# EasyEDA Pro project keyboard_s.eprj

# Schematic Schematic1
Board Name: Board1; Create Date: 2025-11-03; Page Name: P1; Project Name: keyboard_s; Schematic Name: Schematic1; Update Date: 2025-11-05; Company: 嘉立创EDA; Page Size: A4; Version: V1.0
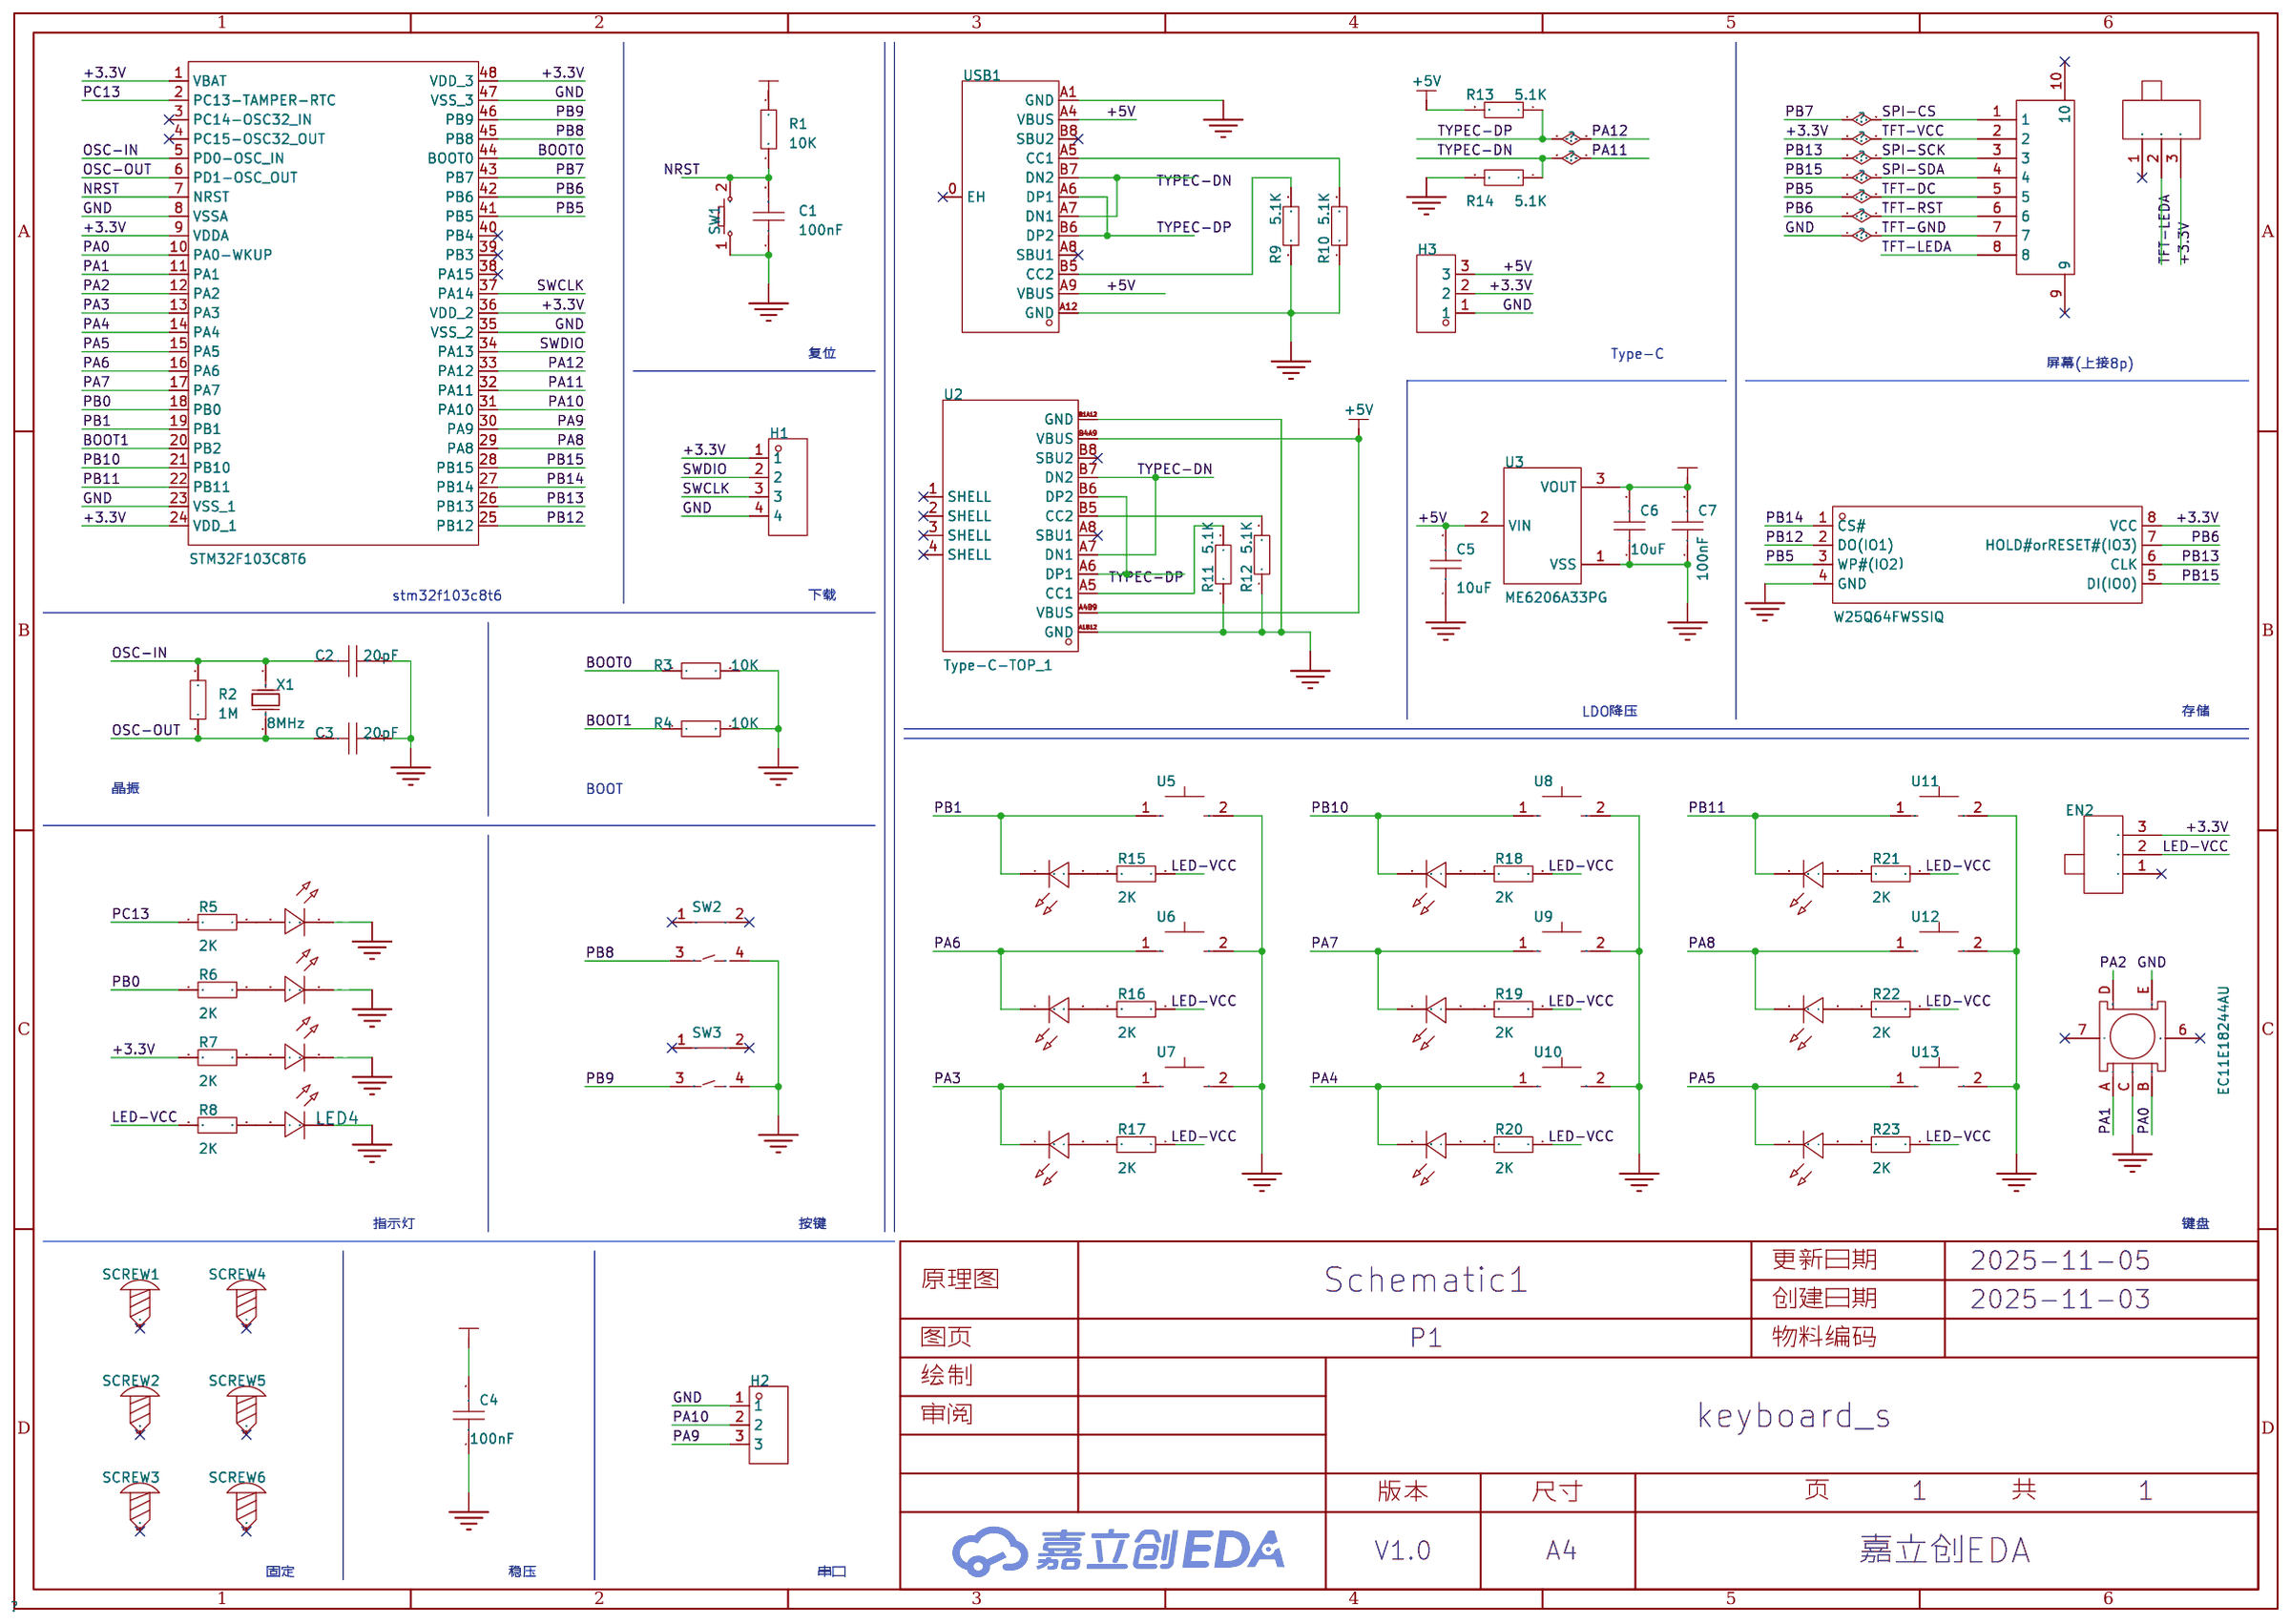
[diagram p0: schematic sheet]

## Parts
C1  100nF  [C0805]
C2  20pF  [C0805]
C3  20pF  [C0805]
C4  100nF  [C0805]
C5  10uF  [C0805]
C6  10uF  [C0805]
C7  100nF  [C0805]
EN1  MK-12C01N-G1.5  [SW-SMD_DEALON_MK-12C01N-G1.5]
EN2  MK-12C01N-G1.5  [SW-SMD_DEALON_MK-12C01N-G1.5]
FPC2  AFC07-S08ECA-00  [FPC-SMD_P0.5-8P_LCS-SH-H2.0]
H1  -  [HDR-TH_4P-P2.54-V-M]
H2  -  [HDR-TH_3P-P2.54-V-M]
H3  -  [HDR-TH_3P-P2.54-V-F]
LED1  -  [LED_0805]
LED2  -  [LED_0805]
LED3  -  [LED_0805]
LED4  -  [LED_0805]
LED5  -  [LED_0805]
LED6  -  [LED_0805]
LED7  -  [LED_0805]
LED8  -  [LED_0805]
LED9  -  [LED_0805]
LED10  -  [LED_0805]
LED11  -  [LED_0805]
LED12  -  [LED_0805]
LED13  -  [LED_0805]
R1  10K  [R0805]
R2  1M  [R0805]
R3  10K  [R0805]
R4  10K  [R0805]
R5  2K  [R0805]
R6  2K  [R0805]
R7  2K  [R0805]
R8  2K  [R0805]
R9  5.1K  [R0805]
R10  5.1K  [R0805]
R11  5.1K  [R0805]
R12  5.1K  [R0805]
R13  5.1K  [R0805]
R14  5.1K  [R0805]
R15  2K  [R0805]
R16  2K  [R0805]
R17  2K  [R0805]
R18  2K  [R0805]
R19  2K  [R0805]
R20  2K  [R0805]
R21  2K  [R0805]
R22  2K  [R0805]
R23  2K  [R0805]
SCREW1  -  [M3螺丝]
SCREW2  -  [M3螺丝]
SCREW3  -  [M3螺丝]
SCREW4  -  [M3螺丝]
SCREW5  -  [M3螺丝]
SCREW6  -  [M3螺丝]
SW1  -  [Key_SMD_3x4x2]
SW2  HX-2x4x3.5CA-2.5N  [SW-SMD_HX-2X4X3.5CA-2.5N]
SW3  HX-2x4x3.5CA-2.5N  [SW-SMD_HX-2X4X3.5CA-2.5N]
SW4  EC11E18244AU  [SW-TH_EC11XXXXXXXX]
U1  STM32F103C8T6  [LQFP-48_L7.0-W7.0-P0.50-LS9.0-BL]
U2  Type-C-TOP_1  [USB-C-SMD_TYPE-C16PIN]
U3  ME6206A33PG  [SOT-89-3_L4.5-W2.5-P1.50-LS4.2-BR]
U4  W25Q64FWSSIQ  [SOIC-8_L5.3-W5.3-P1.27-LS8.0-BL]
U5  -  [高特轴-轴座]
U6  -  [高特轴-轴座]
U7  -  [高特轴-轴座]
U8  -  [高特轴-轴座]
U9  -  [高特轴-轴座]
U10  -  [高特轴-轴座]
U11  -  [高特轴-轴座]
U12  -  [高特轴-轴座]
U13  -  [高特轴-轴座]
USB1  TYPE-C 16P QTWT  [USB-TYPE-C-SMD_TYPE-C-16P-QTWT]
X1  8MHz  [CRYSTAL-SMD_L11.5-W4.8-LS12.7]

## Library data of the parts
C1-C7 = CAP_0805: Supplier Footprint: 0805
EN1 EN2 = MK-12C01N-G1.5: 电路结构:单刀双掷;安装方式:卧贴;开关颜色:黑色;机械寿命:-;; LCSC Part Name: 微型拨动开关; Supplier Part: C2904923; Manufacturer: DEALON(德艺隆); Supplier Footprint: SMD; JLCPCB Part Class: 扩展库; Datasheet: https://atta.szlcsc.com/upload/public/pdf/source/20211116/DB0E76B2A5CCB6919F2C3E33154185CD.pdf; Supplier: LCSC; Circuit: 单刀双掷; Actuator Style: 矩形柱状; Pin Style: 鸥翼型; Switch Length: 7mm; Switch Width: 1.5mm; Switch Height: 4.5mm; Mounting Style: 卧贴; Actuator Color: 黑色
FPC2 = AFC07-S08ECA-00: LCSC Part Name: 间距:0.5mm P数:8P 抽屉式 上接; Supplier Part: C262581; Manufacturer: JS(钜硕电子); Supplier Footprint: SMD,P=0.5mm,卧贴; JLCPCB Part Class: 扩展库; Datasheet: https://atta.szlcsc.com/upload/public/pdf/source/20190726/C11082_A2E7B12387019CE4314BB5199EE0FDF4.pdf; Supplier: LCSC; Locking Feature: 抽屉式; Contact Type: 上接; Number of Contacts: 8P; Pitch: 0.5mm; Mounting Type: 卧贴; FFC, FCB Thickness: 0.3mm; Height Above Board: 2mm
H1 = HDR-M_2.54_1x4P: Supplier Part: C492403; Supplier Footprint: 插件
H2 = HDR-M_2.54_1x3P: Supplier Part: C2937625; Supplier Footprint: 插件
H3 = HDR-F_2.54_1x3P: Supplier Part: C541850; Supplier Footprint: 插件
LED1 LED2 LED5-LED13 = LED_0805-B: Supplier Footprint: 0805
LED3 = LED_0805-G: Supplier Footprint: 0805
LED4 = LED_0805-R: Supplier Footprint: 0805
R1-R23 = Res_0805: Supplier Footprint: 0805
SCREW1-SCREW6 = M3螺丝: Supplier Footprint: 插件
SW1 = Key_SMD_3x4x2: Supplier Footprint: SMD
SW2 SW3 = HX-2x4x3.5CA-2.5N: 电路结构:单刀单掷;按钮形状:-;作用力:2.5N;安装方式:卧贴;开关长度:4.55mm;开关宽度:1.8mm;开关高度:3.5mm;带支架:不带支架;触点电流:50mA;额定电压:12V;带灯:无;工作寿命:2万次;; LCSC Part Name: 4.55*1.8*3.5mm 卧贴 轻触开关; Supplier Part: C49234137; Manufacturer: hanxia(韩下); Supplier Footprint: SMD; JLCPCB Part Class: 扩展库; Datasheet: https://item.szlcsc.com/datasheet/HX-2x4x3.5CA-2.5N/51650198.html; Supplier: LCSC; Circuit: 单刀单掷; Operating Force: 2.5N; Mounting Type: 卧贴; Length: 4.55mm; Width: 1.8mm; Switch Height: 3.5mm; with Bracket: 不带支架; Contact Current: 50mA; Voltage Rating: 12V; Actuator/Cap Color: 黑色; With Lamp: 无; Termination Style: SMD接片; Life: 2万次
SW4 = EC11E18244AU: Supplier Part: C202365; Manufacturer: ALPSALPINE(阿尔卑斯阿尔派); Supplier Footprint: 插件; JLCPCB Part Class: 扩展库; Datasheet: https://item.szlcsc.com/datasheet/EC11E18244AU/203565.html; Supplier: LCSC
U1 = STM32F103C8T6_C9900100366: Supplier Part: C9900100366; Supplier Footprint: TH-6P; JLCPCB Part Class: 扩展库; Supplier: LCSC
U2 = Type-C-TOP_1: Supplier Part: C9900005857; Supplier Footprint: Type-C16P; JLCPCB Part Class: 扩展库; Supplier: LCSC
U3 = ME6206A33PG: 输出类型:固定;工作电压:6V;输出电压:3.3V;输出电流:300mA;电源纹波抑制比(PSRR):50dB@(1kHz);输出极性:正极;; LCSC Part Name: 输入6V 输出3.3V 300mA; Supplier Part: C79022; Manufacturer: MICRONE(南京微盟); Supplier Footprint: SOT-89-3; JLCPCB Part Class: 扩展库; Datasheet: https://item.szlcsc.com/datasheet/ME6206A33PG/80159.html; Supplier: LCSC; Output Type: 固定; Voltage - Supply: 6V; Output Voltage: 3.3V; Output Current: 300mA; Power Supply Rejection Ratio (PSRR): 50dB@(1kHz); Voltage Dropout: 180mV@(80mA)；380mV@(200mA); standby current: 9uA; Features: 过流保护; Operating Temperature: -25℃~+85℃; Output Configuration: 正极; Number of Outputs: 1
U4 = W25Q64FWSSIQ: Supplier Part: C783717; Manufacturer: WINBOND(华邦); Supplier Footprint: SOIC-8-208mil; JLCPCB Part Class: 扩展库; Datasheet: https://atta.szlcsc.com/upload/public/pdf/source/20200914/C783717_9592DB26B3553414A1014E6A69EB35F2.pdf; Supplier: LCSC
U5-U13 = 高特轴-轴座
USB1 = TYPE-C 16P QTWT: LCSC Part Name: Type-C 母 卧贴; Supplier Part: C5187472; Manufacturer: SHOU HAN(首韩); Supplier Footprint: SMD; JLCPCB Part Class: 扩展库; Datasheet: https://item.szlcsc.com/datasheet/TYPE-C%252016P%2520QTWT/5860367.html; Supplier: LCSC; Connector Type: Type-C; Protocol Standard: USB 3.1; Gender: 母; Mounting Type: 卧贴; Number of Contacts: 16P; Number of Ports: 1; Current Rating-Power: 3A; Voltage Rating: 5V; Connect-Disconnect Life: 5千次; Detection color: 黑色; Operating Temperature: -25℃~+85℃
X1 = X49SM8MSD2SC: 晶振类型:贴片晶振;频率:8MHz;常温频差:±20ppm;外接负载电容:20pF;频率稳定度(全温):±30ppm;; LCSC Part Name: 8MHz ±20ppm 20pF; Supplier Part: C12674; Manufacturer: YXC(扬兴晶振); Supplier Footprint: HC-49S-SMD; JLCPCB Part Class: 基础库; Datasheet: https://atta.szlcsc.com/upload/public/pdf/source/20240329/3EBF42EBCAB50CA65B6FA9D7CFA1955A.pdf; Supplier: LCSC; Crystal Type: 贴片晶振; Normal temperature Frequency Tolerance: ±20ppm; External load capacitor: 20pF; Frequency Stability(Full temperature range): ±30ppm; Operating Temperature: -20℃~+70℃; Check: true

## Nets
+3.3V: C4.2 C6.2 C7.2 EN1.3 EN2.3 FPC2.2 H1.1 H3.2 R1.2 R7.1 U1.1(VBAT) U1.9(VDDA) U1.24(VDD_1) U1.36(VDD_2) U1.48(VDD_3) U3.3(VOUT) U4.8(VCC)
+5V: C5.2 H3.3 R13.2 U2.A4B9(VBUS) U2.B4A9(VBUS) U3.2(VIN) USB1.A4(VBUS) USB1.A9(VBUS)
GND: C1.1 C2.2 C3.2 C4.1 C5.1 C6.1 C7.1 FPC2.7 H1.4 H2.1 H3.1 LED1.1(C) LED2.1(C) LED3.1(C) LED4.1(C) R3.2 R4.2 R9.1 R10.1 R11.1 R12.1 R14.2 SW1.1 SW2.4 SW3.4 SW4.C SW4.E U1.8(VSSA) U1.23(VSS_1) U1.35(VSS_2) U1.47(VSS_3) U2.A1B12(GND) U2.B1A12(GND) U3.1(VSS) U4.4(GND) U5.2 U6.2 U7.2 U8.2 U9.2 U10.2 U11.2 U12.2 U13.2 USB1.A1(GND) USB1.A12(GND)
BOOT0: R3.1 U1.44(BOOT0)
BOOT1: R4.1 U1.20(PB2)
LED-VCC: EN2.2 R8.1 R15.1 R16.1 R17.1 R18.1 R19.1 R20.1 R21.1 R22.1 R23.1
NRST: C1.2 R1.1 SW1.2 U1.7(NRST)
OSC-IN: C2.1 R2.2 U1.5(PD0-OSC_IN) X1.1(OSC1)
OSC-OUT: C3.1 R2.1 U1.6(PD1-OSC_OUT) X1.2(OSC2)
PA0: SW4.B U1.10(PA0-WKUP)
PA1: SW4.A U1.11(PA1)
PA2: SW4.D U1.12(PA2)
PA3: LED7.1(C) U1.13(PA3) U7.1
PA4: LED10.1(C) U1.14(PA4) U10.1
PA5: LED13.1(C) U1.15(PA5) U13.1
PA6: LED6.1(C) U1.16(PA6) U6.1
PA7: LED9.1(C) U1.17(PA7) U9.1
PA8: LED12.1(C) U1.29(PA8) U12.1
PA9: H2.3 U1.30(PA9)
PA10: H2.2 U1.31(PA10)
PA11: R14.1 U1.32(PA11) U2.A7(DN1) U2.B7(DN2) USB1.A7(DN1) USB1.B7(DN2)
PA12: R13.1 U1.33(PA12) U2.A6(DP1) U2.B6(DP2) USB1.A6(DP1) USB1.B6(DP2)
PB0: R6.1 U1.18(PB0)
PB1: LED5.1(C) U1.19(PB1) U5.1
PB5: FPC2.5 U1.41(PB5) U4.3(WP#(IO2）)
PB6: FPC2.6 U1.42(PB6) U4.7(HOLD#orRESET#(IO3))
PB7: FPC2.1 U1.43(PB7)
PB8: SW2.3 U1.45(PB8)
PB9: SW3.3 U1.46(PB9)
PB10: LED8.1(C) U1.21(PB10) U8.1
PB11: LED11.1(C) U1.22(PB11) U11.1
PB12: U1.25(PB12) U4.2(DO(IO1))
PB13: FPC2.3 U1.26(PB13) U4.6(CLK)
PB14: U1.27(PB14) U4.1(CS#)
PB15: FPC2.4 U1.28(PB15) U4.5(DI(IO0))
PC13: R5.1 U1.2(PC13-TAMPER-RTC)
SWCLK: H1.3 U1.37(PA14)
SWDIO: H1.2 U1.34(PA13)
TFT-LEDA: EN1.2 FPC2.8
$1N3220: LED2.2(A) R6.2
$1N3613: LED9.2(A) R19.2
$1N3993: R11.2 U2.A5(CC1)
$1N3998: R12.2 U2.B5(CC2)
$1N4409: LED3.2(A) R7.2
$1N4735: LED12.2(A) R22.2
$1N4737: LED13.2(A) R23.2
$1N4739: LED11.2(A) R21.2
$1N4741: LED8.2(A) R18.2
$1N4743: LED10.2(A) R20.2
$1N4745: LED7.2(A) R17.2
$1N4747: LED6.2(A) R16.2
$1N4749: LED5.2(A) R15.2
$1N5293: LED4.2(A) R8.2
$1N7275: R9.2 USB1.B5(CC2)
$1N7284: R10.2 USB1.A5(CC1)
$1N9357: LED1.2(A) R5.2

Not connected (* = marked no-connect by the designer): EN1 1*; EN2 1*; FPC2 9* 10*; SCREW1 1*; SCREW2 1*; SCREW3 1*; SCREW4 1*; SCREW5 1*; SCREW6 1*; SW2 1* 2*; SW3 1* 2*; SW4 6* 7*; U1 3(PC14-OSC32_IN)* 4(PC15-OSC32_OUT)* 38(PA15)* 39(PB3)* 40(PB4)*; U2 1(SHELL)* 2(SHELL)* 3(SHELL)* 4(SHELL)* A8(SBU1)* B8(SBU2)*; USB1 0(EH)* A8(SBU1)* B8(SBU2)*

## Notes on the sheet
- 复位
- Type-C
- 屏幕(上接8p)
- stm32f103c8t6
- 下载
- LDO降压
- 存储
- 晶振
- BOOT
- 指示灯
- 按键
- 键盘
- 固定
- 稳压
- 串口

# Board PCB1
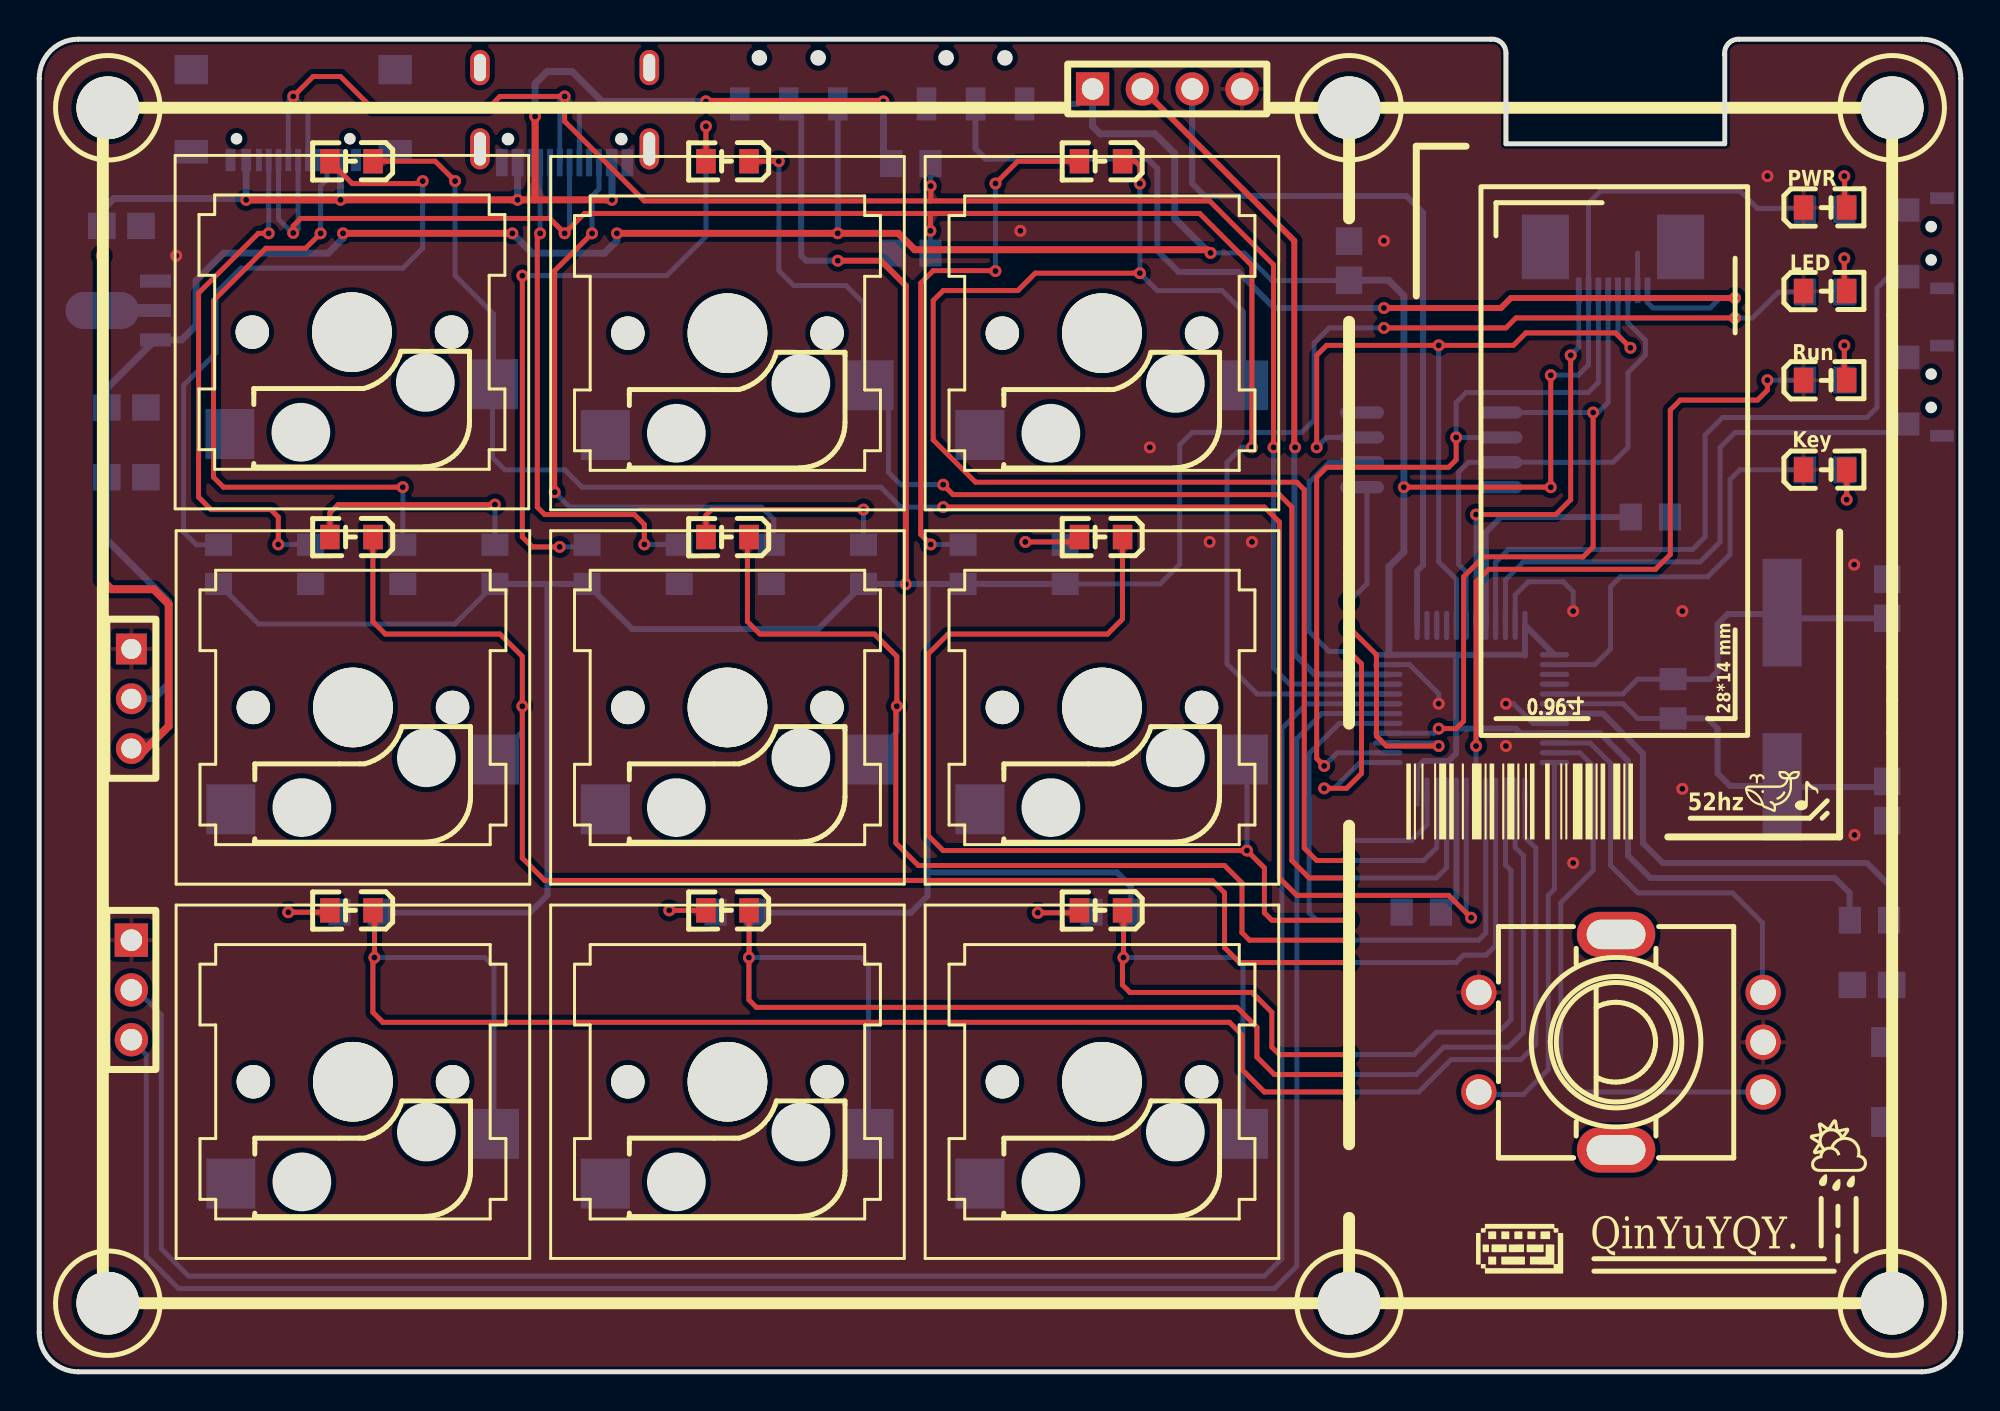
[diagram p1: board, top side]
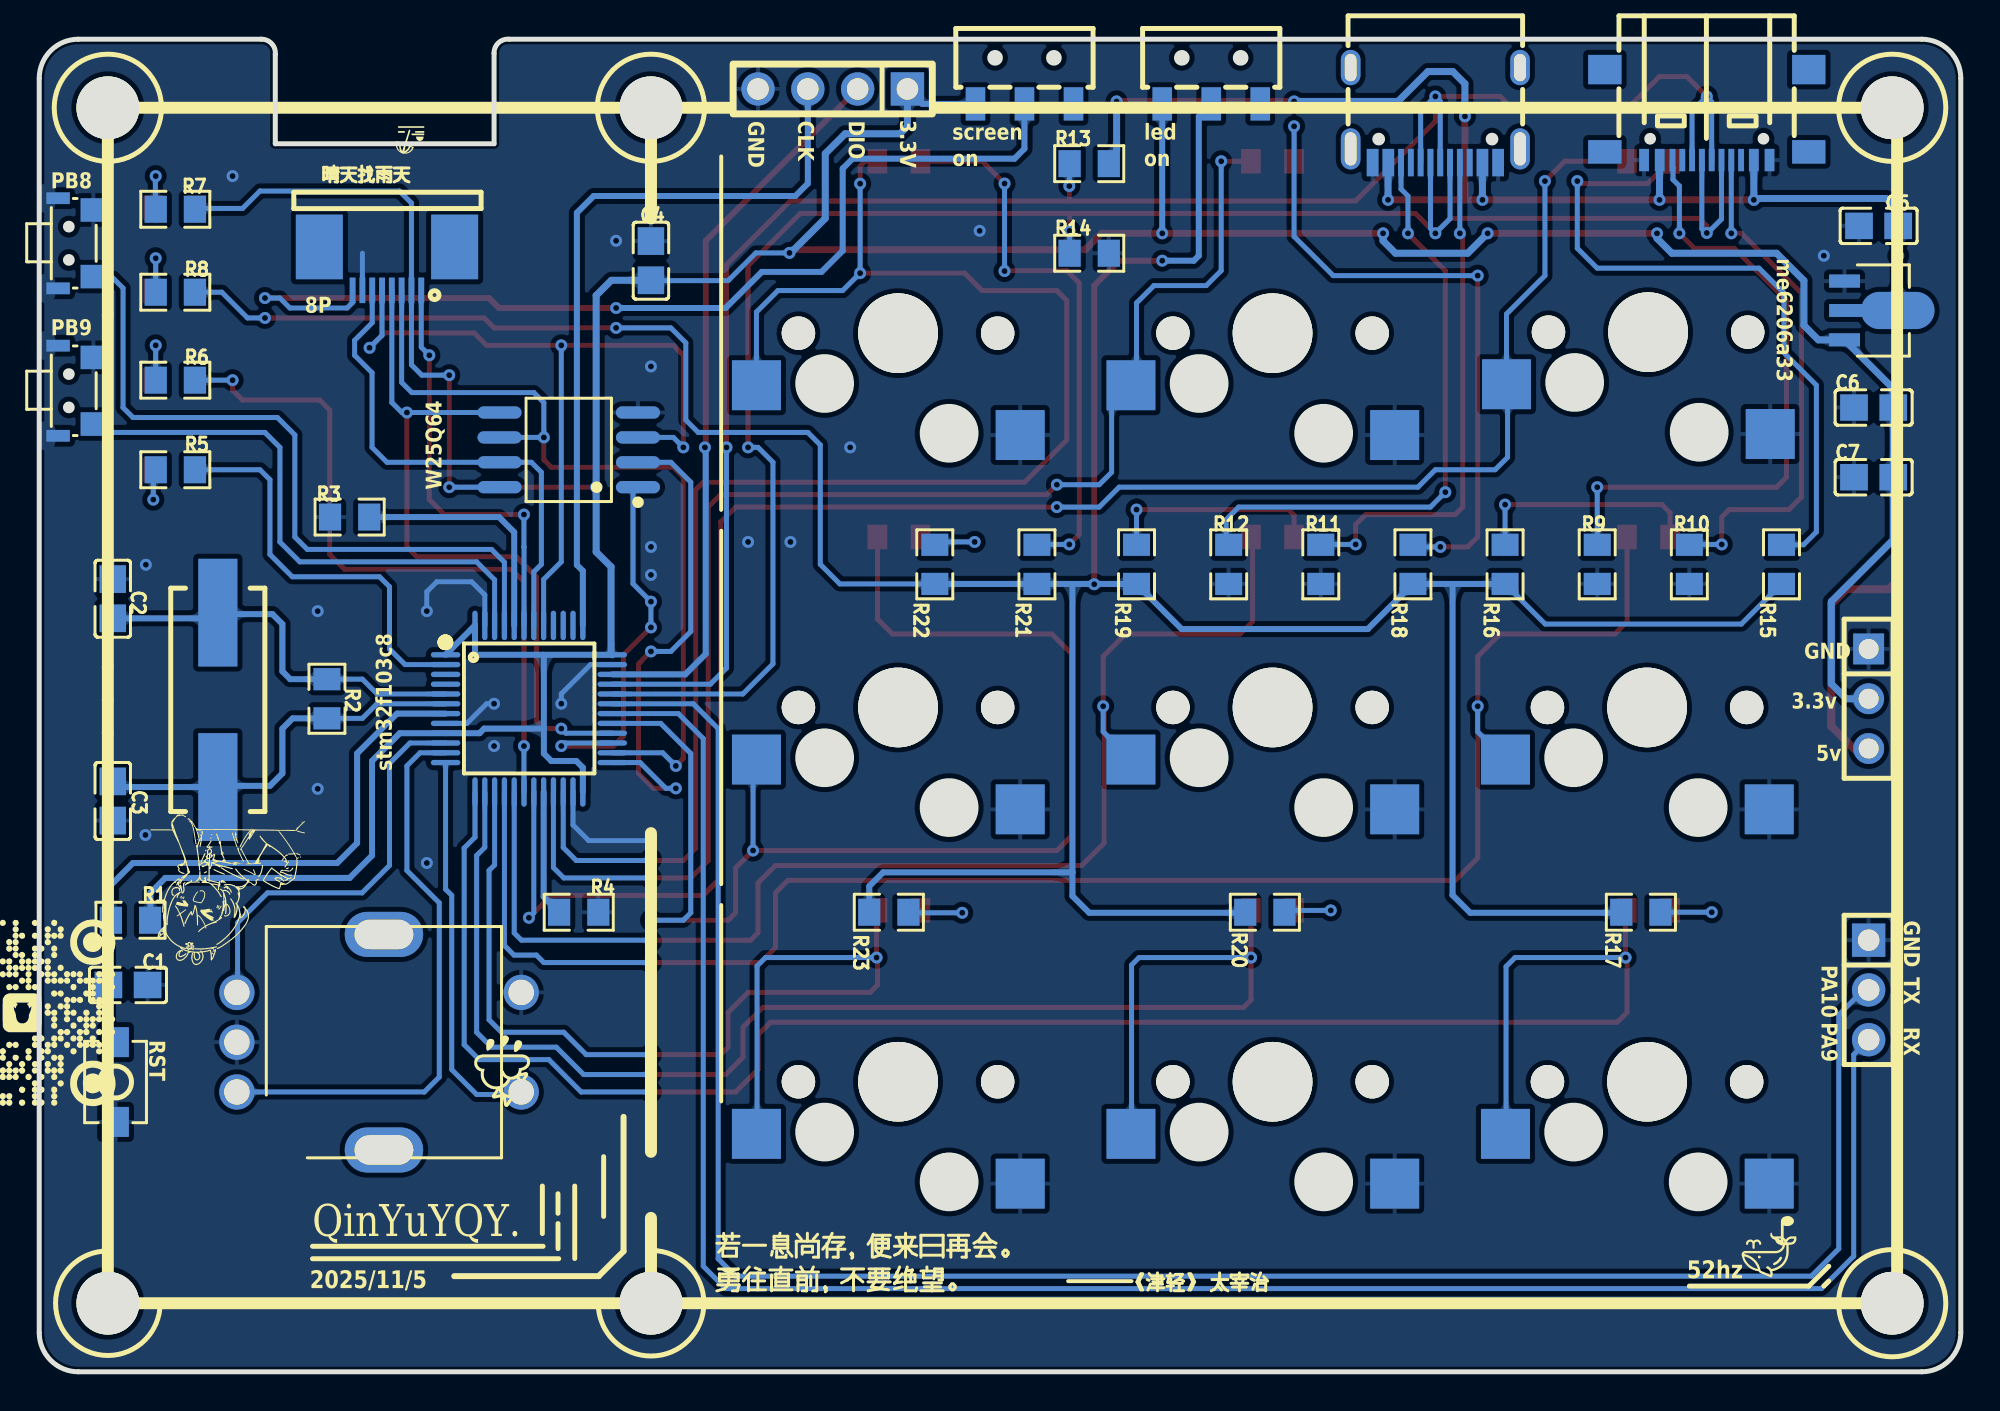
[diagram p2: board, bottom side, seen from below]

Outline 98 x 68 mm; copper layers: Top Layer, Bottom Layer. Coordinates in mm from the lower left corner of the outline.
Outline path: 0,66 arc(0.59,67.41) 2,68 74.03,68 arc(74.58,67.81) 74.8,67.27 74.8,62.67 85.96,62.67 85.96,67.22 arc(86.15,67.78) 86.69,68 96,68 arc(97.41,67.41) 98,66 98,2 arc(97.41,0.59) 96,0 2,0 arc(0.59,0.59) 0,2 0,66
Stack: Top Layer 0.035mm / Dielectric1 1.51mm FR4 er 4.5 / Bottom Layer 0.035mm

## Design rules (mm)
net OSC-IN: DP2
net OSC-OUT: DP2
net PA11: DP1
net PA12: DP1
template: 自定义配置
spacing copperThickness1oz (default): track to track 0.102, other pairs 0.152 to 0.3
spacing copperThickness2oz: track to track 0.203, other pairs 0.152 to 0.3
track width copperThickness1oz (default): min 0.127, default 0.254, max 2.54
track width copperThickness2oz: min 0.203, default 0.254, max 2.54
differential pair differentialPair (default): width min 0.127, default 0.254, max 2.54; gap min 0.152, default 0.152
via viaSize (default): diameter min 0.5, default 0.61, max 10; hole min 0.3, default 0.305, max 6.3

## Placement (name value [footprint] x y rotation side)
C1  100nF  [C0805]  93.47 19.74 0 bottom
C2  20pF  [C0805]  94.25 39.45 90 bottom
C3  20pF  [C0805]  94.25 29.13 270 bottom
C4  100nF  [C0805]  66.8 56.7 270 bottom
C5  10uF  [C0805]  4.19 58.47 180 bottom
C6  10uF  [C0805]  4.44 49.2 180 bottom
C7  100nF  [C0805]  4.44 45.65 180 bottom
EN1  MK-12C01N-G1.5  [SW-SMD_DEALON_MK-12C01N-G1.5]  47.75 64.7 0 bottom
EN2  MK-12C01N-G1.5  [SW-SMD_DEALON_MK-12C01N-G1.5]  38.23 64.7 0 bottom
FPC2  AFC07-S08ECA-00  [FPC-SMD_P0.5-8P_LCS-SH-H2.0]  80.26 56.32 180 bottom
H1  -  [HDR-TH_4P-P2.54-V-M]  57.53 65.46 0 bottom
H2  -  [HDR-TH_3P-P2.54-V-M]  4.7 19.49 270 bottom
H3  -  [HDR-TH_3P-P2.54-V-F]  4.7 34.34 270 bottom
LED1  -  [LED_0805]  91.13 46.03 0 top
LED2  -  [LED_0805]  91.13 50.59 0 top
LED3  -  [LED_0805]  91.13 59.41 0 top
LED4  -  [LED_0805]  91.13 55.14 0 top
LED5  -  [LED_0805]  15.88 61.78 180 top
LED6  -  [LED_0805]  15.88 42.6 180 top
LED7  -  [LED_0805]  15.88 23.55 180 top
LED8  -  [LED_0805]  35.05 61.78 180 top
LED9  -  [LED_0805]  35.05 42.6 180 top
LED10  -  [LED_0805]  35.05 23.55 180 top
LED11  -  [LED_0805]  54.1 61.78 180 top
LED12  -  [LED_0805]  54.1 42.6 180 top
LED13  -  [LED_0805]  54.1 23.55 180 top
R1  10K  [R0805]  93.34 23.04 180 bottom
R2  1M  [R0805]  83.33 34.34 90 bottom
R3  10K  [R0805]  82.17 43.62 0 bottom
R4  10K  [R0805]  70.49 23.45 180 bottom
R5  2K  [R0805]  91.06 46.03 0 bottom
R6  2K  [R0805]  91.06 50.6 0 bottom
R7  2K  [R0805]  91.06 59.32 0 bottom
R8  2K  [R0805]  91.06 55.09 0 bottom
R9  5.1K  [R0805]  18.54 41.2 90 bottom
R10  5.1K  [R0805]  13.84 41.2 90 bottom
R11  5.1K  [R0805]  32.64 41.2 90 bottom
R12  5.1K  [R0805]  37.34 41.2 90 bottom
R13  5.1K  [R0805]  44.45 61.65 180 bottom
R14  5.1K  [R0805]  44.45 57.08 180 bottom
R15  2K  [R0805]  9.14 41.2 90 bottom
R16  2K  [R0805]  23.24 41.2 90 bottom
R17  2K  [R0805]  16.31 23.45 180 bottom
R18  2K  [R0805]  27.94 41.2 90 bottom
R19  2K  [R0805]  42.04 41.2 90 bottom
R20  2K  [R0805]  35.49 23.45 180 bottom
R21  2K  [R0805]  47.12 41.2 90 bottom
R22  2K  [R0805]  52.32 41.2 90 bottom
R23  2K  [R0805]  54.67 23.45 180 bottom
SCREW1  -  [M3螺丝]  3.5 64.5 0 top
SCREW2  -  [M3螺丝]  94.5 3.5 0 top
SCREW3  -  [M3螺丝]  3.5 3.5 0 top
SCREW4  -  [M3螺丝]  94.5 64.5 0 top
SCREW5  -  [M3螺丝]  66.8 64.5 0 top
SCREW6  -  [M3螺丝]  66.8 3.5 0 top
SW1  -  [Key_SMD_3x4x2]  94.11 14.79 90 bottom
SW2  HX-2x4x3.5CA-2.5N  [SW-SMD_HX-2X4X3.5CA-2.5N]  96.14 57.59 90 bottom
SW3  HX-2x4x3.5CA-2.5N  [SW-SMD_HX-2X4X3.5CA-2.5N]  96.14 50.06 90 bottom
SW4  EC11E18244AU  [SW-TH_EC11XXXXXXXX]  80.67 16.82 90 top
U1  STM32F103C8T6  [LQFP-48_L7.0-W7.0-P0.50-LS9.0-BL]  73.03 33.84 270 bottom
U2  Type-C-TOP_1  [USB-C-SMD_TYPE-C16PIN]  26.8 64.19 0 bottom
U3  ME6206A33PG  [SOT-89-3_L4.5-W2.5-P1.50-LS4.2-BR]  4.57 54.16 0 bottom
U4  W25Q64FWSSIQ  [SOIC-8_L5.3-W5.3-P1.27-LS8.0-BL]  70.99 47.05 90 bottom
U5  -  [高特轴-轴座]  15.95 53.05 180 bottom
U6  -  [高特轴-轴座]  16 33.9 180 bottom
U7  -  [高特轴-轴座]  16 14.8 180 bottom
U8  -  [高特轴-轴座]  35.1 53 180 bottom
U9  -  [高特轴-轴座]  35.1 33.9 180 bottom
U10  -  [高特轴-轴座]  35.1 14.8 180 bottom
U11  -  [高特轴-轴座]  54.2 53 180 bottom
U12  -  [高特轴-轴座]  54.2 33.9 180 bottom
U13  -  [高特轴-轴座]  54.2 14.8 180 bottom
USB1  TYPE-C 16P QTWT  [USB-TYPE-C-SMD_TYPE-C-16P-QTWT]  12.95 64.14 0 bottom
X1  8MHz  [CRYSTAL-SMD_L11.5-W4.8-LS12.7]  88.89 34.29 270 bottom

## Footprints (pads in the part's own frame, mm; a bottom-side part is the same pattern mirrored in y, then rotated)
C0805
  rect 1.41x1.35 smd: 1(-1,0) 2(1,0)
CRYSTAL-SMD_L11.5-W4.8-LS12.7
  rect 5.5x2 smd: 1(-4.45,0) 2(4.45,0)
FPC-SMD_P0.5-8P_LCS-SH-H2.0
  rect 0.3x1.3 smd: 1(1.748,-1.133) 2(1.248,-1.133) 3(0.748,-1.133) 4(0.248,-1.133) 5(-0.252,-1.133) 6(-0.752,-1.133) 7(-1.252,-1.133) 8(-1.754,-1.133)
  rect 2.4x3.3 smd: 9(3.45,1.084) 10(-3.45,1.084)
HDR-TH_3P-P2.54-V-F
  rect 1.575x1.575 hole 1.02: 1(-2.54,0)
  round 1.575 hole 1.02: 2(0,0) 3(2.54,0)
HDR-TH_3P-P2.54-V-M
  rect 1.7x1.7 hole 1.1: 1(-2.54,0)
  round 1.7 hole 1.1: 2(0,0) 3(2.54,0)
HDR-TH_4P-P2.54-V-M
  rect 1.7x1.7 hole 1.1: 1(-3.81,0)
  round 1.7 hole 1.1: 2(-1.27,0) 3(1.27,0) 4(3.81,0)
Key_SMD_3x4x2
  rect 1.53x1.36 smd: 1(-2.035,0) 2(2.035,0)
LED_0805
  rect 1x1.25 smd: 1(-1.15,0.005) 2(1.05,0.005)
LQFP-48_L7.0-W7.0-P0.50-LS9.0-BL
  oval 0.27x1.5 smd: 1(-2.75,-4.25) 2(-2.25,-4.25) 3(-1.75,-4.25) 4(-1.25,-4.25) 5(-0.75,-4.25) 6(-0.25,-4.25) 7(0.25,-4.25) 8(0.75,-4.25) 9(1.25,-4.25) 10(1.75,-4.25) 11(2.25,-4.25) 12(2.75,-4.25) 25(2.75,4.25) 26(2.25,4.25) 27(1.75,4.25) 28(1.25,4.25) 29(0.75,4.25) 30(0.25,4.25) 31(-0.25,4.25) 32(-0.75,4.25) 33(-1.25,4.25) 34(-1.75,4.25) 35(-2.25,4.25) 36(-2.75,4.25)
  oval 1.5x0.27 smd: 13(4.25,-2.75) 14(4.25,-2.25) 15(4.25,-1.75) 16(4.25,-1.25) 17(4.25,-0.75) 18(4.25,-0.25) 19(4.25,0.25) 20(4.25,0.75) 21(4.25,1.25) 22(4.25,1.75) 23(4.25,2.25) 24(4.25,2.75) 37(-4.25,2.75) 38(-4.25,2.25) 39(-4.25,1.75) 40(-4.25,1.25) 41(-4.25,0.75) 42(-4.25,0.25) 43(-4.25,-0.25) 44(-4.25,-0.75) 45(-4.25,-1.25) 46(-4.25,-1.75) 47(-4.25,-2.25) 48(-4.25,-2.75)
M3螺丝
  round 3.2 hole 3.2: 1(0,0)
R0805
  rect 1.133x1.377 smd: 1(-1,0) 2(1,0)
SOIC-8_L5.3-W5.3-P1.27-LS8.0-BL
  oval 0.63x2.25 smd: 1(-1.905,-3.53) 2(-0.635,-3.53) 3(0.635,-3.53) 4(1.905,-3.53) 5(1.905,3.53) 6(0.635,3.53) 7(-0.635,3.53) 8(-1.905,3.53)
SOT-89-3_L4.5-W2.5-P1.50-LS4.2-BR
  rect 1.575x0.672 smd: 1(1.356,-1.5) 3(1.356,1.5)
  custom 5.377x1.9 smd: 2(-1.356,0)
SW-SMD_DEALON_MK-12C01N-G1.5
  rect 1x1.7 smd: 1(-2.5,0) 2(0,0) 3(2.5,0)
SW-SMD_HX-2X4X3.5CA-2.5N
  rect 0.6x1.2 smd: 1(-2.3,0.9) 2(2.3,0.9)
  rect 1.2x1.3 smd: 3(-1.7,-0.9) 4(1.7,-0.9)
SW-TH_EC11XXXXXXXX
  oval 2.3x4 hole 1.5x3: 6(5.5,0.25) 7(-5.5,0.25)
  round 1.8 hole 1.3: A(-2.54,-7.25) B(2.54,-7.25) C(0,-7.25) D(-2.54,7.25) E(2.54,7.25)
USB-C-SMD_TYPE-C16PIN
  oval 1x2.1 hole 0.6x1.7: 1(-4.32,1.788) 2(4.32,1.788)
  oval 1x1.8 hole 0.6x1.4: 3(-4.32,-2.362) 4(4.32,-2.362)
  rect 0.6x1.4 smd: A1B12(-3.2,2.487) A4B9(-2.4,2.487) B1A12(3.2,2.487) B4A9(2.4,2.487)
  rect 0.3x1.4 smd: A5(-1.25,2.487) A6(-0.25,2.487) A7(0.25,2.487) A8(1.25,2.487) B5(1.75,2.487) B6(0.75,2.487) B7(-0.75,2.487) B8(-1.75,2.487)
USB-TYPE-C-SMD_TYPE-C-16P-QTWT
  rect 1.7x1.5 smd: 0(-5.2,-2.309) 0(5.2,-2.309)
  rect 1.7x1.2 smd: 0(-5.2,1.891) 0(5.2,1.891)
  rect 0.5x1.14 smd: A1(-3.2,2.308) A4(-2.4,2.308) A9(2.4,2.308) A12(3.2,2.308)
  rect 0.3x1.14 smd: A5(-1.25,2.308) A6(-0.25,2.308) A7(0.25,2.308) A8(1.25,2.309) B5(1.75,2.308) B6(0.75,2.308) B7(-0.75,2.308) B8(-1.75,2.309)
高特轴-轴座
  round 1.702 hole 1.707x1.702: (-5.08,0) (5.08,0)
  round 4.064 hole 4.069x4.064: (0,0)
  rect 2.5x2.55 smd: 1(-7.221,-2.658) 2(6.229,-5.198)

## Nets
As in the schematic.

Pads without a net: EN1 1; EN2 1; FPC2 9 10; SCREW1 1; SCREW2 1; SCREW3 1; SCREW4 1; SCREW5 1; SCREW6 1; SW2 1 2; SW3 1 2; SW4 6 7; U1 3 4 38 39 40; U2 1 2 3 4 A8 B8; USB1 0 A8 B8

## Via types
v1: diameter 0.61, hole 0.305, Top Layer to Bottom Layer, 117 vias

## Routing (per net, layer and track width the routed paths; a pad name or vN(x,y) marks a point on that pad's centre or on a via; arc(x,y) is an arc through that point)
+3.3V: length 218.4
  Top Layer w0.254: v1(77.09,50.86) v1(77.09,45.14) v1(69.6,45.14)
  Top Layer w0.355: v1(24.13,58.09) v1(15.49,58.09) ; v1(29.46,58.09) v1(40.73,58.09) 43.81,58.09 44.65,57.26 59.57,57.26 v1(59.74,57.09)
  Bottom Layer w0.254: v1(59.74,57.09) 61.45,57.09 62.87,55.68 66.79,55.68 C4.2 ; v1(77.09,50.86) 78.49,50.86 79.02,51.39 FPC2.2 79.02,59.64 79.63,60.25 86.74,60.25 87.63,59.36 90.02,59.36 R7.1 ; U4.8 v1(77.09,45.14)
  Bottom Layer w0.305: EN2.3 v1(40.73,58.09) ; H1.1 52.96,64.7 EN1.3 ; 72.26,32.85 72.29,32.82 75.31,32.82 75.54,32.59 U1.9 79.61,32.59 81.03,31.17 81.03,26.34 82.17,25.2 91.57,25.2 92.33,24.44 92.33,23.06 R1.2 ; 72.26,32.85 72.26,36.54 72.31,36.59 ; 72.26,32.85 72.26,31.55 71.88,31.17 70.61,31.17 70.28,30.83 U1.24 ; U1.1 U1.48 75.78,36.55 75.74,36.59 72.31,36.59 ; U1.36 72.31,36.59
  Bottom Layer w0.355: v1(24.13,58.09) 25.15,57.08 28.83,57.08 29.46,57.71 v1(29.46,58.09) ; U1.36 68.83,36.65 68.83,41.08 69.6,41.84 v1(69.6,45.14) 69.6,54.92 68.82,55.7 C4.2 ; v1(59.74,57.09) 59.67,57.09 57.91,58.86 57.91,62.16 56.9,63.17 54.1,63.17 53.72,63.56 H1.1 ; H3.2 5.84,34.34 6.6,35.11 6.6,39.3 3.44,42.46 C7.2 C6.2 3.44,50.17 U3.3 7.26,52.66 8,53.39 8,55.68 9.4,57.08 14.73,57.08 15.49,57.84 v1(15.49,58.09)
+5V: length 95.7
  Top Layer w0.355: 34.04,64.83 v1(43.05,64.83) ; 25.29,59.8 v1(24.4,59.8) 15.37,59.8 ; 25.29,59.8 v1(25.29,64.06) ; 25.29,59.8 v1(29.21,59.8) ; v1(10.55,59.8) v1(15.37,59.8)
  Top Layer w0.406: v1(3.19,56.95) 3.19,40.42 3.68,39.93 5.84,39.93 6.6,39.17 6.6,32.95 5.33,31.68
  Bottom Layer w0.355: v1(43.05,64.83) 43.05,62.3 43.45,61.9 ; v1(29.21,59.8) 29.21,61.82 29.2,61.83 ; 34.04,64.83 28.7,64.83 27.18,66.35 25.91,66.35 25.29,65.73 v1(25.29,64.06) ; v1(15.37,59.8) 15.37,61.82 USB1.A9 ; USB1.A4 v1(10.55,59.8) 10.48,59.87 3.81,59.87 3.17,59.24 3.17,58.49 C5.2 v1(3.19,56.95) 3.19,54.18 U3.2 ; 24.4,61.83 v1(24.4,59.8)
  vias: v1(34,64.83)
GND: length 20.5
  Bottom Layer w0.254: v1(71.37,34.09) 71.37,34.6 69.89,36.09 U1.35 ; v1(78.23,38.82) 78.23,39.81 77.72,40.31 75.95,40.31 75.28,39.64 U1.47 ; FPC2.7 81.52,57.08 ; v1(74.8,34.09) 75.18,34.09 76.19,33.09 U1.8 ; v1(66.8,27.11) 69.98,27.11 70.78,27.9 U1.23
  vias: v1(6.98,56.95) v1(50.04,58.22) v1(56.64,47.17) v1(59.69,42.35) v1(61.85,42.35) v1(66.8,51.3) v1(66.8,42.09) v1(66.8,40.66) v1(68.58,57.71) v1(74.8,31.93) v1(78.23,25.96) v1(83.8,38.82) v1(83.8,29.75) v1(88.14,61.02) v1(92.56,41.18) v1(92.58,27.39) v1(94.5,53.92) v1(94.5,35.96) v1(94.5,34.28) v1(94.5,32.59)
BOOT0: length 12.5
  Bottom Layer w0.305: R3.1 74.55,43.62 73.78,42.84 U1.44
BOOT1: length 6.5
  Bottom Layer w0.305: U1.20 72.28,24.24 R4.1
LED-VCC: length 187.7
  Top Layer w0.254: v1(86.49,53.78) 75.31,53.78 74.8,53.27 v1(68.58,53.27)
  Top Layer w0.305: v1(44.2,40.19) 44.2,55.43 42.93,56.7 v1(40.73,56.7)
  Bottom Layer w0.254: v1(68.58,53.27) 65.79,53.27 65.02,52.51 65.02,48.57 64.39,47.93 58.8,47.93 58.17,47.3 58.17,41.2 57.17,40.2 R22.1 ; R8.1 88.69,55.09 87.38,53.78 v1(86.49,53.78) ; R16.1 21.19,38.16 11.19,38.16 R15.1
  Bottom Layer w0.305: R17.1 17.34,23.42 25.02,23.42 25.92,24.32 25.92,40.2 ; R22.1 R21.1 45.3,40.2 ; 25.92,40.2 R18.1 30.24,37.9 39.74,37.9 R19.1 45.3,40.2 ; 25.92,40.2 R16.1 ; 45.3,25.49 45.3,24.28 44.45,23.42 36.52,23.42 R20.1 ; 45.3,25.49 54.96,25.49 55.67,24.78 R23.1 ; 45.3,25.49 45.3,40.2 ; v1(40.73,56.7) 39.12,56.7 38.86,56.95 38.86,64.06 EN2.2
NRST: length 31.6
  Bottom Layer w0.254: SW1.2 94.47,17.19 C1.2 94.47,22.92 R1.1
  Bottom Layer w0.305: U1.7 79.75,33.59 81.79,31.55 81.79,26.98 82.8,25.96 93.22,25.96 94.34,24.84 R1.1
OSC-IN: length 20.2
  Bottom Layer w0.254: R2.2 81.52,35.34 80.76,34.59 U1.5
  Bottom Layer w0.305: R2.2 85.2,35.34 85.6,35.74 85.6,38.16 86.11,38.66 88.82,38.66 X1.1 89.18,38.45 C2.1
OSC-OUT: length 20.2
  Bottom Layer w0.254: R2.1 81.52,33.34 80.78,34.09 U1.6
  Bottom Layer w0.305: C3.1 93.96,29.84 X1.2 88.83,29.9 86.23,29.9 85.6,30.53 85.6,32.82 85.08,33.34 R2.1
PA0: length 21
  Bottom Layer w0.254: U1.10 79.09,32.09 80.14,31.04 80.14,25.84 81.53,24.44 86.36,24.44 87.88,22.92 87.88,19.39 SW4.B
PA1: length 29.4
  Bottom Layer w0.254: U1.11 78.58,31.59 79.25,30.92 79.25,25.58 77.6,23.93 77.6,15.04 78.36,14.28 SW4.A
PA2: length 19.9
  Bottom Layer w0.254: U1.12 77.28,24.62 76.96,24.31 76.96,15.42 75.69,14.15 73.55,14.15 SW4.D
PA3: length 96.2
  Top Layer w0.254: 17.1,23.55 17.1,21.14 v1(17.09,21.14) 17.02,21.06 17.02,18.34 17.53,17.83 60.71,17.83 61.34,17.2 61.34,15.42 62.48,14.28 v1(66.8,14.28)
  Bottom Layer w0.254: U1.13 75.78,27.28 76.33,26.72 76.33,16.69 75.56,15.93 72.01,15.93 70.36,14.28 v1(66.8,14.28) ; v1(17.09,21.14) 22.73,21.14 23.19,20.68 23.19,12.17 U7.1
PA4: length 74.7
  Top Layer w0.254: LED10.1 36.2,21.14 v1(36.19,21.14) 36.19,18.98 36.58,18.6 61.09,18.6 62.1,17.58 62.1,16.06 62.99,15.17 66.8,15.17
  Bottom Layer w0.254: v1(36.19,21.14) 41.91,21.14 42.29,20.76 42.29,12.17 U10.1 ; 66.8,15.17 70.23,15.17 71.63,16.56 74.93,16.56 75.69,17.33 75.69,26.34 75.28,26.76 U1.14
  vias: v1(66.8,15.23)
PA5: length 53.6
  Top Layer w0.254: 55.3,23.55 55.3,21.14 v1(55.29,21.14) 55.25,21.09 55.25,19.74 55.63,19.36 61.85,19.36 62.87,18.34 62.87,16.56 63.25,16.18 66.68,16.18 66.8,16.06
  Bottom Layer w0.254: v1(55.29,21.14) 60.96,21.14 61.39,20.71 61.39,12.17 U13.1 ; 66.8,16.06 66.93,16.18 70.1,16.18 71.25,17.33 74.42,17.33 75.06,17.96 75.06,25.58 74.78,25.86 U1.15
  vias: v1(66.8,16.18)
PA6: length 87.9
  Top Layer w0.254: v1(66.8,20.88) 61.21,20.88 60.45,21.64 60.45,24.44 59.82,25.07 25.78,25.07 24.64,26.22 v1(24.64,33.96) 24.64,36.5 23.5,37.65 17.65,37.65 17.02,38.28 17.02,42.59 LED6.1
  Bottom Layer w0.254: U6.1 24.64,32.66 v1(24.64,33.96) ; v1(66.8,20.88) 72.26,20.88 72.64,21.26 73.79,21.26 74.28,21.75 U1.16
PA7: length 66.6
  Top Layer w0.254: 66.8,21.9 66.68,22.03 61.72,22.03 61.34,22.41 61.34,24.95 60.45,25.84 44.83,25.84 43.69,26.98 43.69,33.91 v1(43.74,33.96) 43.74,36.5 42.59,37.65 36.75,37.65 36.12,38.28 36.12,42.59 36.12,42.59
  Bottom Layer w0.254: U1.17 73.78,22.39 73.41,22.03 66.93,22.03 66.8,21.9 ; U9.1 43.74,32.66 v1(43.74,33.96)
  vias: v1(66.8,21.96)
PA8: length 68.4
  Top Layer w0.254: v1(66.8,23.04) 62.87,23.04 62.48,23.42 62.48,25.71 v1(61.59,26.6) 46.1,26.6 45.34,27.36 45.34,36.63 46.35,37.65 54.48,37.65 55.25,38.41 55.25,42.59 LED12.1
  Bottom Layer w0.254: U1.29 66.31,33.09 64.77,31.55 64.77,23.42 65.15,23.04 v1(66.8,23.04) ; v1(61.59,26.6) 61.59,31.07 U12.1
PA9: length 103.3
  Bottom Layer w0.254: U1.30 65.41,33.59 64.13,32.31 64.13,5.39 62.99,4.25 7.11,4.25 5.46,5.9 5.46,16.18 H2.3
PA10: length 104.6
  Bottom Layer w0.254: 5.08,19.36 6.22,18.22 6.22,6.28 7.62,4.88 62.48,4.88 63.37,5.77 63.37,32.82 64.64,34.09 U1.31
PA11: length 98.8
  Top Layer w0.254: v1(12.95,58.11) 12.95,58.47 13.33,58.86 26.03,58.86 v1(26.8,58.09) 27.81,59.11 45.42,59.11 ; v1(45.45,58.22) 45.45,59.08 45.42,59.11 ; 45.42,59.11 59.18,59.11 61.85,56.44 v1(61.85,47.17)
  Bottom Layer w0.254: U2.B7 26.05,58.84 v1(26.8,58.09) 27.05,58.34 U2.A7 ; 13.2,61.67 13.2,58.32 12.95,58.07 12.2,58.82 12.2,61.67 ; v1(61.85,47.17) 61.34,47.17 60.58,46.41 60.58,36.12 62.12,34.59 U1.32 ; 45.45,56.82 v1(45.45,58.22)
PA12: length 98.8
  Top Layer w0.254: 45.45,59.75 59.69,59.75 62.95,56.49 v1(62.95,47.17) ; 45.45,59.75 45.47,59.77 v1(45.47,60.51) ; 45.45,59.75 30.86,59.75 26.8,63.81 v1(26.8,65.08) 23.5,65.08 22.86,64.44 17.02,64.44 15.37,66.09 13.97,66.09 v1(12.95,65.08)
  Bottom Layer w0.254: U2.A6 26.55,64.83 v1(26.8,65.08) 27.55,64.33 U2.B6 ; v1(45.47,60.51) 45.47,61.89 45.45,61.9 ; U1.33 63.77,35.09 62.95,35.91 v1(62.95,47.17) ; 12.95,65.05 12.7,64.8 12.7,61.67 ; USB1.B6 13.7,64.33 v1(12.95,65.08)
PB0: length 36.4
  Top Layer w0.254: v1(73.28,31.93) 73.28,40.31 73.91,40.95 82.42,40.95 83.19,41.71 83.19,49.08 83.69,49.58 87.63,49.58 88.14,50.09 v1(88.14,50.6)
  Bottom Layer w0.254: v1(73.28,31.93) 73.28,29.59 U1.18 ; v1(88.14,50.6) R6.1
PB1: length 96.3
  Top Layer w0.254: v1(46.1,44.12) 62.48,44.12 63.25,43.36 63.25,25.2 64.13,24.31 71.88,24.31 v1(73.03,23.17) ; v1(21.21,60.76) 20.19,61.78 17.03,61.78 LED5.1
  Bottom Layer w0.254: U1.19 72.78,23.42 v1(73.03,23.17) ; v1(46.1,44.12) 43.94,44.12 42.93,45.14 27.69,45.14 26.8,46.03 23.75,46.03 23.11,46.66 23.11,50.34 U5.1 23.17,53.97 21.21,55.94 v1(21.21,60.76)
PB5: length 41.9
  Top Layer w0.254: v1(65.15,47.17) 65.15,51.87 65.66,52.38 v1(71.37,52.38) 75.18,52.38 75.82,53.01 80.39,53.01 v1(81.15,52.25)
  Bottom Layer w0.254: v1(71.37,52.38) 71.37,41.33 72.28,40.43 U1.41 ; U4.3 65.66,47.68 v1(65.15,47.17) ; v1(81.15,52.25) 80.52,52.89 80.52,55.18 FPC2.5
PB6: length 25.9
  Bottom Layer w0.254: FPC2.6 81.02,53.53 81.91,52.63 81.91,51.87 81.03,50.98 81.03,47.17 80.26,46.41 U4.7 72.9,46.41 72.39,45.9 72.39,41.2 72.78,40.82 U1.42
PB7: length 21.6
  Top Layer w0.254: v1(73.28,43.74) 77.34,43.74 78.1,44.5 v1(78.1,51.87)
  Bottom Layer w0.254: U1.43 73.28,42.09 73.28,42.09 v1(73.28,43.74) ; v1(78.1,51.87) 78.52,52.28 FPC2.1
PB8: length 36.8
  Bottom Layer w0.254: SW2.3 95.16,55.81 94.23,55.81 93.73,55.3 93.73,49.2 93.22,48.7 85.85,48.7 84.96,47.81 84.96,42.6 84.33,41.97 74.93,41.97 74.28,41.31 U1.45
PB9: length 28.9
  Bottom Layer w0.254: U1.46 74.78,40.41 75.69,41.33 84.71,41.33 85.72,42.35 85.72,47.17 86.49,47.93 94.81,47.93 SW3.3
PB10: length 72.9
  Top Layer w0.254: LED8.1 v1(37.72,61.77) ; v1(46.1,45.27) 46.61,44.76 63.25,44.76 63.88,44.12 63.88,26.09 64.77,25.2 v1(66.8,25.2)
  Bottom Layer w0.254: v1(66.8,25.2) 71.25,25.2 71.78,25.73 U1.21 ; v1(37.72,61.77) 37.72,56.19 38.48,55.43 41.15,55.43 42.04,54.54 42.04,50.63 U8.1 43.31,49.36 43.31,45.9 43.94,45.27 v1(46.1,45.27)
PB11: length 82.9
  Top Layer w0.254: LED11.1 55.26,61.78 55.88,61.78 56.13,61.52 v1(56.13,60.63) ; 66.8,26.09 65.15,26.09 64.52,26.72 64.52,45.01 64.13,45.39 47.75,45.39 45.59,47.55 45.59,54.67 46.1,55.17 49.91,55.17 50.8,56.06 v1(56.13,56.06)
  Bottom Layer w0.254: U11.1 61.42,54.08 60.32,55.17 57.02,55.17 v1(56.13,56.06) v1(56.13,60.63) ; 66.8,26.09 70.61,26.09 71.28,26.75 U1.22
  vias: v1(66.8,26.15)
PB12: length 25.7
  Top Layer w0.254: v1(65.53,29.77) 66.68,29.77 67.44,30.53 67.44,36.12 v1(66.8,36.76)
  Bottom Layer w0.254: v1(65.53,29.77) 66.04,29.77 67.35,31.09 U1.25 ; v1(66.8,36.76) 65.79,36.76 64.77,37.77 64.77,45.39 65.79,46.41 U4.2
PB13: length 43.4
  Top Layer w0.254: v1(65.53,30.92) 65.15,31.3 65.15,45.65 65.66,46.16 71.88,46.16 72.26,46.54 v1(72.26,47.68)
  Bottom Layer w0.254: U1.26 66.2,31.59 v1(65.53,30.92) ; U4.6 v1(72.26,47.68) 72.26,49.46 72.77,49.97 78.99,49.97 79.52,50.49 FPC2.3
PB14: length 19.8
  Top Layer w0.254: v1(66.8,37.99) 68.2,36.59 68.2,32.44 68.71,31.93 v1(71.37,31.93)
  Bottom Layer w0.254: v1(66.8,37.99) v1(66.8,39.3) 67.72,40.21 67.72,44.89 U4.1 ; U1.27 71.22,32.09 v1(71.37,31.93)
PB15: length 37
  Top Layer w0.254: v1(79.25,48.95) 79.25,42.09 78.74,41.58 73.66,41.58 72.64,40.57 72.64,33.2 72.26,32.82 v1(71.37,32.82)
  Bottom Layer w0.254: U1.28 71.14,32.59 v1(71.37,32.82) ; FPC2.4 80.02,49.46 79.5,48.95 U4.5
PC13: length 21
  Bottom Layer w0.254: U1.2 79.34,36.09 80.14,36.89 80.14,40.06 80.65,40.57 85.09,40.57 86.23,41.71 86.23,45.52 86.74,46.03 R5.1
SWCLK: length 38.4
  Bottom Layer w0.305: 58.8,65.46 58.8,60.63 59.44,60 69.72,60 70.58,59.14 70.58,41.17 70.28,40.87 U1.37
SWDIO: length 37.3
  Top Layer w0.305: v1(64.05,47.17) 64.01,47.21 64.01,57.71 H1.2
  Bottom Layer w0.305: U1.34 65.05,35.59 64.01,36.63 64.01,47.13 v1(64.05,47.17)
TFT-LEDA: length 52.5
  Top Layer w0.305: v1(68.58,54.28) 74.55,54.28 75.06,54.79 v1(86.49,54.79)
  Bottom Layer w0.254: FPC2.8 82.02,54.56 82.3,54.28 85.22,54.28 85.72,54.79 v1(86.49,54.79)
  Bottom Layer w0.305: v1(68.58,54.28) 62.99,54.28 61.15,56.13 58.1,56.13 57.02,57.2 57.02,61.4 56.51,61.9 48.26,61.9 47.75,62.41 EN1.2
$1N3220: length 3.6
  Top Layer w0.254: LED2.2 92.06,50.72 v1(92.06,52.38)
  Bottom Layer w0.254: R6.2 v1(92.06,52.38)
$1N3613: length 11.1
  Top Layer w0.254: v1(42.04,44) 34.29,44 34,43.71 LED9.2
  Bottom Layer w0.254: v1(42.04,44) R19.2
$1N3993: length 26.3
  Top Layer w0.254: v1(25.55,58.09) 25.4,57.95 25.4,44.12 25.78,43.74 30.35,43.74 30.86,43.23 v1(30.86,42.22)
  Bottom Layer w0.254: U2.A5 v1(25.55,58.09) ; v1(30.86,42.22) 32.62,42.22 R11.2
$1N3998: length 30.8
  Top Layer w0.254: v1(28.19,58.09) 26.29,56.19 v1(26.29,44.89)
  Bottom Layer w0.254: R12.2 37.47,42.33 37.47,43.49 36.83,44.12 27.05,44.12 v1(26.29,44.89) ; v1(28.19,58.09) 28.19,60 28.55,60.35 U2.B5
$1N4409: length 3.3
  Top Layer w0.254: LED3.2 92.07,59.52 92.07,61.02
  Bottom Layer w0.254: 92.07,61.02 92.07,59.34 R7.2
  vias: v1(92.06,61.02)
$1N4735: length 5
  Top Layer w0.254: v1(50.29,42.35) 52.8,42.35 LED12.2
  Bottom Layer w0.254: R22.2 52.18,42.35 v1(50.29,42.35)
$1N4737: length 4.9
  Top Layer w0.254: LED13.2 52.93,23.42 v1(50.93,23.42)
  Bottom Layer w0.254: v1(50.93,23.42) 53.64,23.42 R23.2
$1N4739: length 28.5
  Top Layer w0.254: v1(48.77,60.63) 49.91,61.77 LED11.2 ; v1(45.47,42.22) 44.96,42.73 44.96,55.55 45.59,56.19 48.75,56.19 v1(48.77,56.17)
  Bottom Layer w0.254: R21.2 47.1,42.22 v1(45.47,42.22) ; v1(48.77,60.63) v1(48.77,56.17)
$1N4741: length 34.5
  Top Layer w0.254: v1(24.64,55.94) 24.64,42.6 25.15,42.09 v1(26.54,42.09) ; LED8.2 v1(34,63.56)
  Bottom Layer w0.254: R18.2 27.83,42.09 v1(26.54,42.09) ; v1(24.64,55.94) 32,55.94 34,57.93 v1(34,63.56)
$1N4743: length 4.3
  Top Layer w0.254: LED10.2 v1(32.13,23.55)
  Bottom Layer w0.254: v1(32.13,23.55) 34.4,23.55 R20.2
$1N4745: length 4.8
  Top Layer w0.254: LED7.2 14.73,23.45 v1(12.7,23.45)
  Bottom Layer w0.254: R17.2 v1(12.7,23.45)
$1N4747: length 11.9
  Top Layer w0.254: v1(23.24,44.25) 15.24,44.25 14.83,43.84 LED6.2
  Bottom Layer w0.254: v1(23.24,44.25) R16.2
$1N4749: length 35.1
  Top Layer w0.254: v1(19.56,60.76) 19.43,60.63 15.96,60.63 LED5.2
  Bottom Layer w0.254: R15.2 8.02,42.2 7.37,42.85 7.37,50.35 9.02,52 9.02,55.05 10.29,56.32 18.54,56.32 19.56,57.33 v1(19.56,60.76)
$1N5293: length 3.5
  Top Layer w0.254: 92.18,55.15 92.06,55.27 v1(92.06,56.82)
  Bottom Layer w0.254: v1(92.06,56.82) R8.2
$1N7275: length 32.6
  Top Layer w0.254: v1(18.54,45.14) 9.4,45.14 8.89,45.65 8.89,54.67 11.56,57.33 13.59,57.33 v1(14.35,58.09)
  Bottom Layer w0.254: v1(14.35,58.09) 14.35,60.51 14.68,60.83 14.68,61.44 14.7,61.47 USB1.B5 ; v1(18.54,45.14) R9.2
$1N7284: length 26.5
  Top Layer w0.254: v1(11.7,58.09) 11.18,58.09 8.13,55.05 8.13,44.63 8.76,44 11.81,44 12.19,43.62 v1(12.19,42.22)
  Bottom Layer w0.254: R10.2 13.83,42.22 v1(12.19,42.22) ; USB1.A5 v1(11.7,58.09)
$1N9357: length 3.1
  Top Layer w0.254: LED1.2 v1(92.18,44.5)
  Bottom Layer w0.254: R5.2 92.18,45.91 v1(92.18,44.5)

## Copper pours and planes (outline as drawn; the poured copper is in the pictures)
GND on Top Layer: 0,68 98,68 98,0 0,0
GND on Bottom Layer: 0,68 98,68 98,0 0,0

Small or netless copper shapes (teardrops, artwork), in the pictures only: 133 on Top Layer, 274 on Bottom Layer

## Text on the board
Bottom Silkscreen Layer: QinYuYQY. | 晴天找雨天 | 5v | GND | 3.3v | TX | RX | PA10 | PA9 | me6206a33 | 3.3V | DIO | CLK | led / on | 《津轻》 太宰治 | screen / on | 8P | PB8 | PB9 | RST | W25Q64 | stm32f103c8 | 52hz | 2025/11/5 | 若一息尚存，便来日再会。 / 勇往直前，不要绝望。
Top Silkscreen Layer: QinYuYQY. | 28*14 mm | 0.96寸 | PWR | LED | Run | Key | 52hz
